# Altium schematic sheet TailLightPrototypeRev3LEDs.SchDoc
size A4; DocumentNumber: 4; SheetNumber: 4; SheetTotal: 4
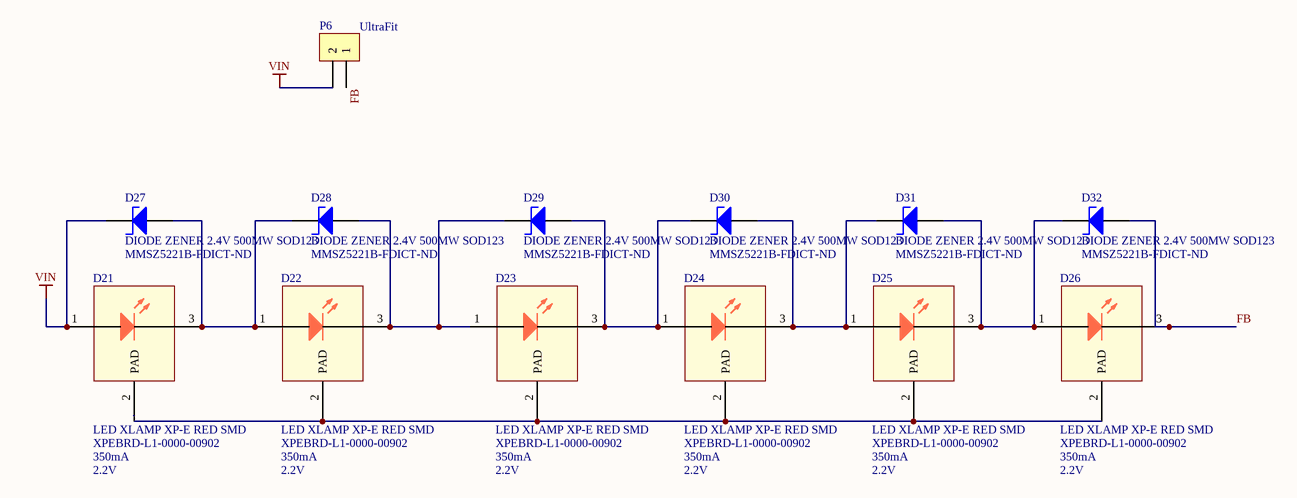
[diagram p0: TailLightPrototypeRev3LEDs.SchDoc]

## Parts
D21  LED XLAMP XP-E RED SMD  Manufacturer Part Number: XPEBRD-L1-0000-00902  Test Current: 350mA  Forward Voltage: 2.2V  [LED CREE XP-E2 1414 2-SMD]
D22  LED XLAMP XP-E RED SMD  Manufacturer Part Number: XPEBRD-L1-0000-00902  Test Current: 350mA  Forward Voltage: 2.2V  [LED CREE XP-E2 1414 2-SMD]
D23  LED XLAMP XP-E RED SMD  Manufacturer Part Number: XPEBRD-L1-0000-00902  Test Current: 350mA  Forward Voltage: 2.2V  [LED CREE XP-E2 1414 2-SMD]
D24  LED XLAMP XP-E RED SMD  Manufacturer Part Number: XPEBRD-L1-0000-00902  Test Current: 350mA  Forward Voltage: 2.2V  [LED CREE XP-E2 1414 2-SMD]
D25  LED XLAMP XP-E RED SMD  Manufacturer Part Number: XPEBRD-L1-0000-00902  Test Current: 350mA  Forward Voltage: 2.2V  [LED CREE XP-E2 1414 2-SMD]
D26  LED XLAMP XP-E RED SMD  Manufacturer Part Number: XPEBRD-L1-0000-00902  Test Current: 350mA  Forward Voltage: 2.2V  [LED CREE XP-E2 1414 2-SMD]
D27  DIODE ZENER 2.4V 500MW SOD123  Supplier Part Number 1: MMSZ5221B-FDICT-ND  [DIODE SOD123]
D28  DIODE ZENER 2.4V 500MW SOD123  Supplier Part Number 1: MMSZ5221B-FDICT-ND  [DIODE SOD123]
D29  DIODE ZENER 2.4V 500MW SOD123  Supplier Part Number 1: MMSZ5221B-FDICT-ND  [DIODE SOD123]
D30  DIODE ZENER 2.4V 500MW SOD123  Supplier Part Number 1: MMSZ5221B-FDICT-ND  [DIODE SOD123]
D31  DIODE ZENER 2.4V 500MW SOD123  Supplier Part Number 1: MMSZ5221B-FDICT-ND  [DIODE SOD123]
D32  DIODE ZENER 2.4V 500MW SOD123  Supplier Part Number 1: MMSZ5221B-FDICT-ND  [DIODE SOD123]
P6  Series: UltraFit  [CONN, 2POS ULTRA-FIT]  (hidden comment: CONN 2POS ULTRA-FIT 0.138")

## Nets
VIN: D21.1(A) D27.1(K) P6.2
FB: D26.3(K) D32.2(A) P6.1
NetD21_2: D21.2(PAD) D22.2(PAD) D23.2(PAD) D24.2(PAD) D25.2(PAD) D26.2(PAD)
NetD21_3: D21.3(K) D22.1(A) D27.2(A) D28.1(K)
NetD22_3: D22.3(K) D23.1(A) D28.2(A) D29.1(K)
NetD23_3: D23.3(K) D24.1(A) D29.2(A) D30.1(K)
NetD24_3: D24.3(K) D25.1(A) D30.2(A) D31.1(K)
NetD25_3: D25.3(K) D26.1(A) D31.2(A) D32.1(K)

## Library data of the parts
D21-D26 = LED XLAMP XP-E RED SMD: LED Lighting Color XLamp® XP-E2 Red 623nm (620nm ~ 625nm) 1414 (3535 Metric); Manufacturer: Cree; Max Current Rating: 1A; Test Temperature: 25°C; Viewing Angle: 130°; Thermal Resistance of Package: 5°C/W; Supplier 1: Digi-Key; Stock 1: 1640; Pricing 1: 1 = 2.00000, 10 = 1.90000, 100 = 1.69980, 250 = 1.54584, 500 = 1.44786 (USD); Mount: Surface Mount; Case/Package: SMD/SMT; Color: Red; Packaging: Tape and Reel; Wavelength: 625nm; Lead Free: Lead Free; Supplier Part Number 1: XPEBRD-L1-0000-00902CT-ND; RoHS: Yes
D27-D32 = DIODE ZENER 2.4V 500MW SOD123: Zener Diode 2.4V 500mW ±5% Surface Mount SOD-123; Manufacturer 1: Diodes; Manufacturer Part Number 1: MMSZ5221B-7-F; Max Reverse Leakage Current: 100uA; Element Configuration: Single; Forward Voltage: 900mV; Impedance: 30R; Test Current: 20mA; Supplier 1: Digi-Key; Stock 1: 37190; Pricing 1: 1=0.19000, 10=0.17800, 100=0.07440, 500=0.05840, 1000=0.04056 (USD); RoHS: Yes; Mount: Surface Mount; Case/Package: SOD-123-2; Number of Pins: 2; Weight: 0.000353oz; Min Operating Temperature: -65°C; Max Operating Temperature: 150°C; Max Power Dissipation: 500mW; Zener Voltage: 2.4V; Packaging: Tape and Reel; Package Quantity: 3000; Tolerance: 5%; Voltage Tolerance: 5%; Power Dissipation: 500mW; Zener Current: 100uA; Working Voltage: 2.4V; Peak Reverse Current: 100uA; Termination: SMD/SMT; Power Rating: 500mW; Voltage Rating (DC): 2.4V; Length: 3.85mm; Height: 1.35mm; Width: 1.7mm; Radiation Hardening: No; Lead Free: Lead Free; ComponentLink1URL: https://datasheet.ciiva.com/34302/1541079-34302404.pdf?src-supplier=Jameco; ComponentLink1Description: https://datasheet.ciiva.com/34302/1541079-34302404.pdf?src-supplier=Jameco; ComponentLink2URL: https://datasheet.ciiva.com/15142/getdatasheetpartid-61111-15142284.pdf?src-supplier=Verical; ComponentLink2Description: https://datasheet.ciiva.com/15142/getdatasheetpartid-61111-15142284.pdf?src-supplier=Verical; ComponentLink3URL: https://datasheet.ciiva.com/4734/ds18010-38133-4734214.pdf?src-supplier=Mouser; ComponentLink3Description: https://datasheet.ciiva.com/4734/ds18010-38133-4734214.pdf?src-supplier=Mouser; ComponentLink4URL: https://datasheet.ciiva.com/890/ds18010-890793.pdf?src-supplier=Digi-Key; ComponentLink4Description: https://datasheet.ciiva.com/890/ds18010-890793.pdf?src-supplier=Digi-Key; ComponentLink5URL: https://datasheet.ciiva.com/890/ds18010-890794.pdf?src-supplier=Digi-Key; ComponentLink5Description: https://datasheet.ciiva.com/890/ds18010-890794.pdf?src-supplier=Digi-Key
P6 = CONN 2POS ULTRA-FIT 0.138": 2 Positions Header, Shrouded Connector 0.138" (3.50mm) Through Hole Gold; Manufacturer 1: Molex, LLC; Manufacturer Part Number 1: 1722861302; Style: Board to Board or Cable; Shrouding: Shrouded - 4 Wall; Number of Positions: 2; Number of Positions Loaded: All; Contact Length - Post: 0.126" (3.20mm); Material Flammability Rating: UL94 V-0; Mated Stacking Heights: 26.99mm; Voltage: 400V; Supplier 1: Digi-Key; Supplier Part Number 1: WM11673-ND; Packaging: Tray; Part Status: Active; Connector Type: Header; Contact Type: Male Pin; Pitch - Mating: 0.138" (3.50mm); Number of Rows: 1; Row Spacing - Mating: -; Mounting Type: Through Hole; Termination: Kinked Pin, Solder; Fastening Type: Latch Holder; Contact Length - Mating: -; Overall Contact Length: -; Insulation Height: 0.465" (11.80mm); Contact Shape: Square; Contact Finish - Mating: Gold; Contact Finish Thickness - Mating: 30µin (0.76µm); Contact Finish - Post: Tin; Contact Material: Copper Alloy; Insulation Material: Liquid Crystal Polymer (LCP); Operating Temperature: -40°C ~ 120°C; Ingress Protection: -; Insulation Color: Black; Current Rating: -; Contact Finish Thickness - Post: 60µin (1.52µm); ComponentLink1URL: http://www.molex.com/pdm_docs/sd/1722861302_sd.pdf; ComponentLink1Description: http://www.molex.com/pdm_docs/sd/1722861302_sd.pdf